# EAGLE design capsense1 (EAGLE 6.6.0)
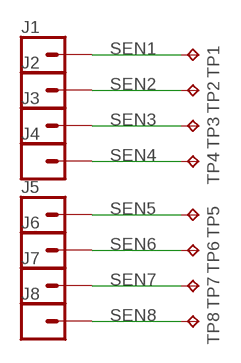
[diagram p0: schematic, sheet 1]

## Parts
J1  CONN_01  [1X01]
J2  CONN_01  [1X01]
J3  CONN_01  [1X01]
J4  CONN_01  [1X01]
J5  CONN_01  [1X01]
J6  CONN_01  [1X01]
J7  CONN_01  [1X01]
J8  CONN_01  [1X01]
TP1  TPTP20R  [TP20R]
TP2  TPTP20R  [TP20R]
TP3  TPTP20R  [TP20R]
TP4  TPTP20R  [TP20R]
TP5  TPTP20R  [TP20R]
TP6  TPTP20R  [TP20R]
TP7  TPTP20R  [TP20R]
TP8  TPTP20R  [TP20R]

## Nets
SEN1: J1.1 TP1.TP
SEN2: J2.1 TP2.TP
SEN3: J3.1 TP3.TP
SEN4: J4.1 TP4.TP
SEN5: J5.1 TP5.TP
SEN6: J6.1 TP6.TP
SEN7: J7.1 TP7.TP
SEN8: J8.1 TP8.TP

## Library data of the parts
J1-J8 = SparkFun-Connectors:CONN_01: Single connection point. Often used as Generic Header-pin footprint for 0.1 inch spaced/style header connections On any of the 0.1 inch spaced packages, you can populate with these: Break Away Headers - Straight <https://www.sparkfun.com/products/116> (PRT-00116) Break Away Male Headers - Right Angle <https://www.sparkfun.com/products/553> (PRT-00553) Female Headers <https://www.sparkfun.com/products/115> (PRT-00115) Break Away Headers - Machine Pin <https://www.sparkfun.com/products/117> (PRT-00117) Break Away Female Headers - Swiss Machine Pin <https://www.sparkfun.com/products/743> (PRT-00743) This device is also useful as a general connection point to wire up your design to another part of your project. Our various solder wires solder well into these plated through hole pads. Hook-Up Wire - Assortment (Stranded, 22 AWG) <https://www.sparkfun.com/products/11375> (PRT-11375) Hook-Up Wire - Assortment (Solid Core, 22 AWG) <https://www.sparkfun.com/products/11367> (PRT-11367) View the entire wire category on our website here <https://www.sparkfun.com/categories/141> Special notes: SMTSO-256-ET is a "flush mount" nut for a 4-40 screw. We mostly use this on specialty testbeds; it is a nice way to connect hardware to your PCB at an adjustable hieght. Also note, the SNAP packages are for using a snappable style connector. We sell a baggie of snaps and they are also used on two LilyPad designs: Snap Assortment - 30 pack (male and female) <https://www.sparkfun.com/products/11347> (DEV-11347) LilyPad Arduino SimpleSnap <https://www.sparkfun.com/products/10941> (DEV-10941) LilyPad SimpleSnap Protoboard <https://www.sparkfun.com/products/10940> (DEV-10940)
TP1-TP8 = testpad:TP: Test pad

## Board
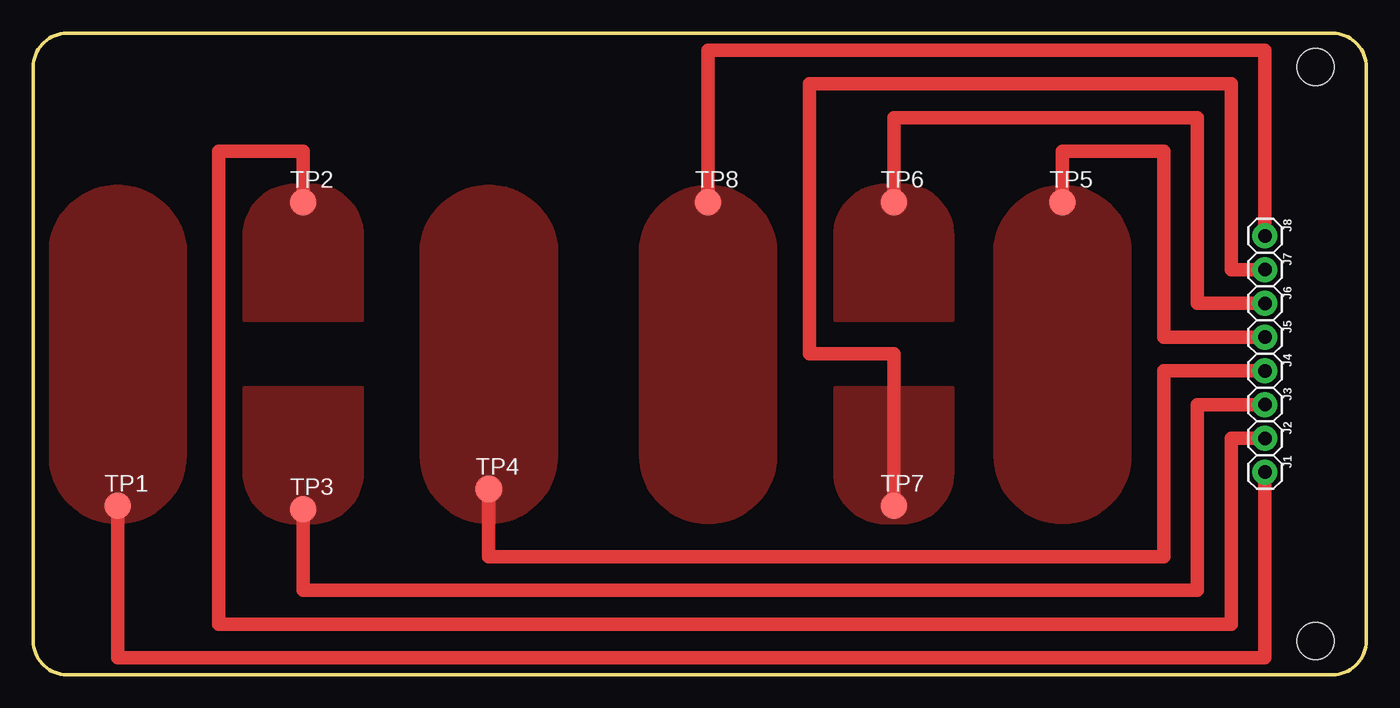
[diagram p1: board, top side]

Size 100.33 x 48.26 mm. Coordinates in mm from the lower left corner, seen from the top.
Outline: 0,45.72 0,2.54 arc90 2.54,0 97.79,0 arc90 100.33,2.54 100.33,45.72 arc90 97.79,48.26 2.54,48.26 arc90 0,45.72
Copper layers (1*16): Top 0.035mm / dielectric 1.5mm / Bottom 0.035mm
Design rules "default": minimum track width 10mil, minimum drill 24mil, track to track 8mil, track to pad 8mil, pad to pad 8mil, via to via 8mil, smd to smd 8mil, copper to edge 40mil, drill to drill 8mil, minimum pad ring 10mil, minimum via ring 8mil, stop-mask expansion 4mil, vias tented up to drill 0mil, thermal gap 10mil
Holes 2.8 mm at 96.52,45.72 96.52,2.54

### Footprints (pad centres in the part's own frame; a part is rotated, then mirrored left to right if it is on the bottom)
1X01 = drill 1.016 pad 1.88: 1 0,0
TP20R = smd 2 x 2: TP 0,0

### Placement (x,y rotation side)
J1  92.71,15.24 270 top
J2  92.71,17.78 270 top
J3  92.71,20.32 270 top
J4  92.71,22.86 270 top
J5  92.71,25.4 270 top
J6  92.71,27.94 270 top
J7  92.71,30.48 270 top
J8  92.71,33.02 270 top
TP1  6.35,12.7 0 top
TP2  20.32,35.56 0 top
TP3  20.32,12.45 0 top
TP4  34.29,13.97 0 top
TP5  77.47,35.56 0 top
TP6  64.77,35.56 0 top
TP7  64.77,12.7 0 top
TP8  50.8,35.56 0 top

### Tracks (layer width: path | path; a pad name or v marks a point on that pad's centre or on a via)
SEN1
  Top 1.016: J1.1 92.71,2.54 92.71,1.27 6.35,1.27 TP1.TP
  pour Top (no thermals): 11.43,32.26 11.43,16.51 arc-180 1.27,16.51 1.27,32.26 arc-166
SEN2
  Top 1.016: J2.1 90.17,17.78 90.17,3.81 13.97,3.81 13.97,24.13 13.97,39.37 20.32,39.37 TP2.TP
  pour Top (no thermals): 15.88,26.67 15.88,33.02 arc-90 19.68,36.83 20.95,36.83 arc-90 24.77,33.02 24.77,26.67
SEN3
  Top 1.016: J3.1 87.63,20.32 87.63,6.35 20.32,6.35 TP3.TP
  pour Top (no thermals): 24.77,21.59 24.77,15.24 arc-90 20.95,11.43 19.68,11.43 arc-90 15.88,15.24 15.88,21.59
SEN4
  Top 1.016: J4.1 85.09,22.86 85.09,11.43 85.09,8.89 34.29,8.89 TP4.TP
  pour Top (no thermals): 39.37,32.26 39.37,16.51 arc-180 29.21,16.51 29.21,32.26 arc-166
SEN5
  Top 1.016: J5.1 85.09,25.4 85.09,26.67 85.09,39.37 77.47,39.37 TP5.TP
  pour Top (no thermals): 82.55,32.26 82.55,16.51 arc-180 72.39,16.51 72.39,32.26 arc-166
SEN6
  Top 1.016: J6.1 87.63,27.94 87.63,41.91 64.77,41.91 TP6.TP
  pour Top (no thermals): 60.33,26.67 60.33,33.02 arc-90 64.14,36.83 65.41,36.83 arc-90 69.22,33.02 69.22,26.67
SEN7
  Top 1.016: J7.1 90.17,30.48 90.17,44.45 58.42,44.45 58.42,39.37 58.42,24.13 64.77,24.13 TP7.TP
  pour Top (no thermals): 69.22,21.59 69.22,15.24 arc-90 65.41,11.43 64.14,11.43 arc-90 60.33,15.24 60.33,21.59
SEN8
  Top 1.016: J8.1 92.71,46.99 50.8,46.99 TP8.TP
  pour Top (no thermals): 55.88,32.26 55.88,16.51 arc-180 45.72,16.51 45.72,32.26 arc-166